# Altium schematic sheet B38_RCCB_M541231.SchDoc
size A4
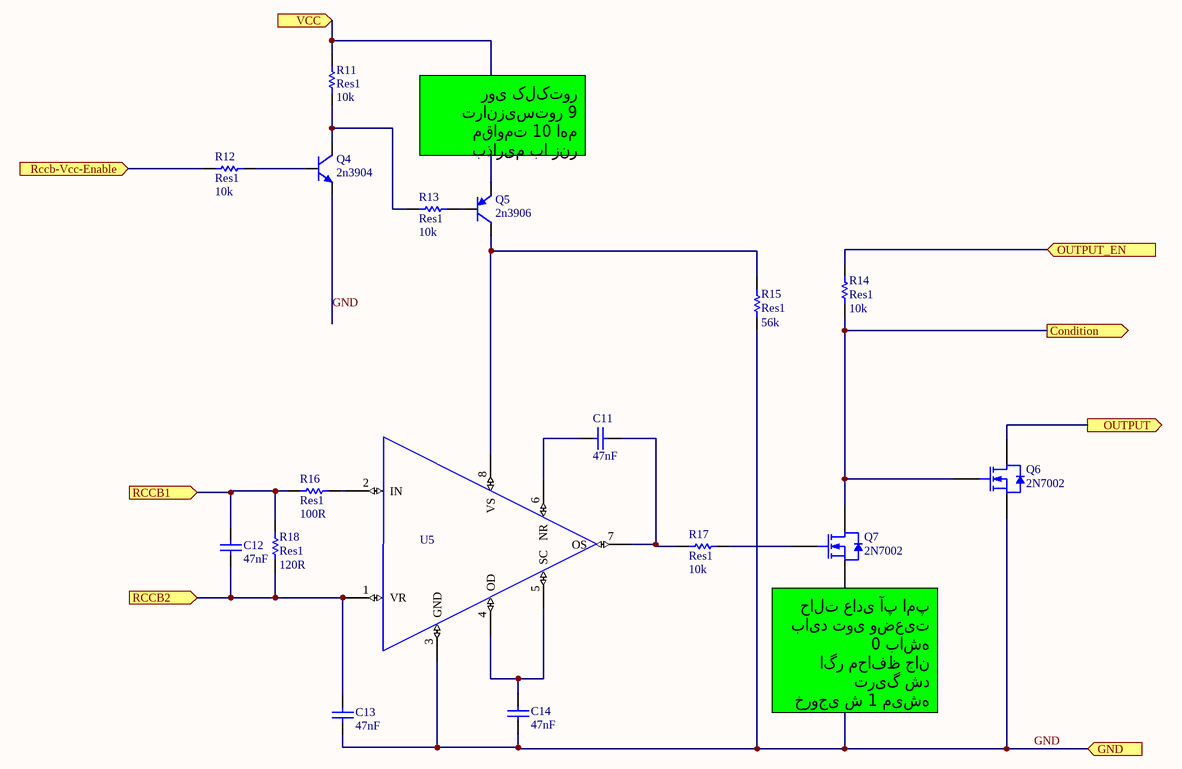
[diagram p0: B38_RCCB_M541231.SchDoc]

## Parts
C11  47nF  [CAP0603]
C12  47nF  [CAP0603]
C13  47nF  [CAP0603]
C14  47nF  [CAP0603]
Q4  2n3904  [sot23]
Q5  2n3906  [sot23]
Q6  2N7002  [sot23]
Q7  2N7002  [sot23]
R11  Res1  value 10k  [RES0603]
R12  Res1  value 10k  [RES0603]
R13  Res1  value 10k  [RES0603]
R14  Res1  value 10k  [RES0603]
R15  Res1  value 56k  [RES0603]
R16  Res1  value 100R  [RES0603]
R17  Res1  value 10k  [RES0603]
R18  Res1  value 120R  [RES0603]
U5  opamp  [SO-8]  (value not drawn)

## Ports
Condition (out), GND (in), OUTPUT (out), OUTPUT_EN (in), RCCB1 (in), RCCB2 (in), Rccb-Vcc-Enable (in), VCC (in)

## Nets
Condition: Q6.1(G) Q7.3(D) R14.2 ; port Condition
GND: C13.2 C14.2 Q4.2(E) Q6.2(S) Q7.2(S) R15.2 U5.3(GND) ; port GND
OUTPUT: Q6.3(D) ; port OUTPUT
OUTPUT_EN: R14.1 ; port OUTPUT_EN
RCCB1: C12.1 R16.2 R18.1 ; port RCCB1
RCCB2: C12.2 C13.1 R18.2 U5.1(VR) ; port RCCB2
Rccb-Vcc-Enable: R12.1 ; port Rccb-Vcc-Enable
VCC: Q5.2(E) R11.2 ; port VCC
NetC11_1: C11.1 R17.2 U5.7(OS)
NetC11_2: C11.2 U5.6(NR)
NetC14_1: C14.1 U5.4(OD) U5.5(SC)
NetQ4_1: Q4.1(B) R12.2
NetQ4_3: Q4.3(C) R11.1 R13.2
NetQ5_1: Q5.1(B) R13.1
NetQ5_3: Q5.3(C) R15.1 U5.8(VS)
NetQ7_1: Q7.1(G) R17.1
NetR16_1: R16.1 U5.2(IN)

## Notes on the sheet
- روی کلکتور ترانزیستور 9 مقاومت 10 اهم بذاریم با زنر
- (near Q7) حالت عادی آپ امپ باید توی وضعیت 0 باشه
  اگر محافظ جان تریگ شد
  خروجی ش 1 میشه

## Library data of the parts
C11-C14 = CAP-SMT: 47nF ±5% 50V X7R 0603 Multilayer Ceramic Capacitors MLCC - SMD/SMT; Value: 47nF
Q4 = NPN: E-mail: picpars@gmail.com; De: Seyed Mohsen Ghasemian; web: www.picpars.com
Q5 = PNP: PNP Bipolar Transistor; Published: 8-Jun-2000; LatestRevisionDate: 29-May-2009; LatestRevisionNote: IPC-7351 Footprint Added.; PackageVersion: Aug-1999; PackageReference: SOT-23B; Publisher: Altium Limited; PackageDescription: 3-Pin SOT-23 Package 0.95 mm Pitch, 2.4 mm Lead Span
Q6 Q7 = FDD6690A: MOSFET N-CH 60V 115MA SOT23-3; Manufacturer: Diode; PN: 2N7002-7-F; Value: 2N7002
R11-R15 R17 = Res1: Resistor; Published: 8-Jun-2000; LatestRevisionDate: 17-Jul-2002; LatestRevisionNote: Re-released for DXP Platform.; PackageReference: AXIAL-0.3; Publisher: Altium Limited; PackageDescription: Axial Device, Thru-Hole; 2 Leads; 0.3 in Pin Spacing
R16 = Res1: 100mW Thick Film Resistors 50V ±1% ±100ppm/℃ 100Ω -55℃~+125℃ 0603 Chip Resistor - Surface Mount ROHS; Published: 8-Jun-2000; LatestRevisionDate: 17-Jul-2002; LatestRevisionNote: Re-released for DXP Platform.; PackageReference: AXIAL-0.3; Publisher: Altium Limited; PackageDescription: Axial Device, Thru-Hole; 2 Leads; 0.3 in Pin Spacing
R18 = Res1: 100mW Thick Film Resistors 50V ±1% ±100ppm/℃ 120Ω -55℃~+125℃ 0603 Chip Resistor - Surface Mount ROHS; Published: 8-Jun-2000; LatestRevisionDate: 17-Jul-2002; LatestRevisionNote: Re-released for DXP Platform.; PackageReference: AXIAL-0.3; Publisher: Altium Limited; PackageDescription: Axial Device, Thru-Hole; 2 Leads; 0.3 in Pin Spacing
U5 = M54123L: EARTH LEAKAGE CURRENT DETECTOR